# EAGLE design TSOC_GROVEY_I2CHUB_R2_1 (EAGLE 6.6.0)
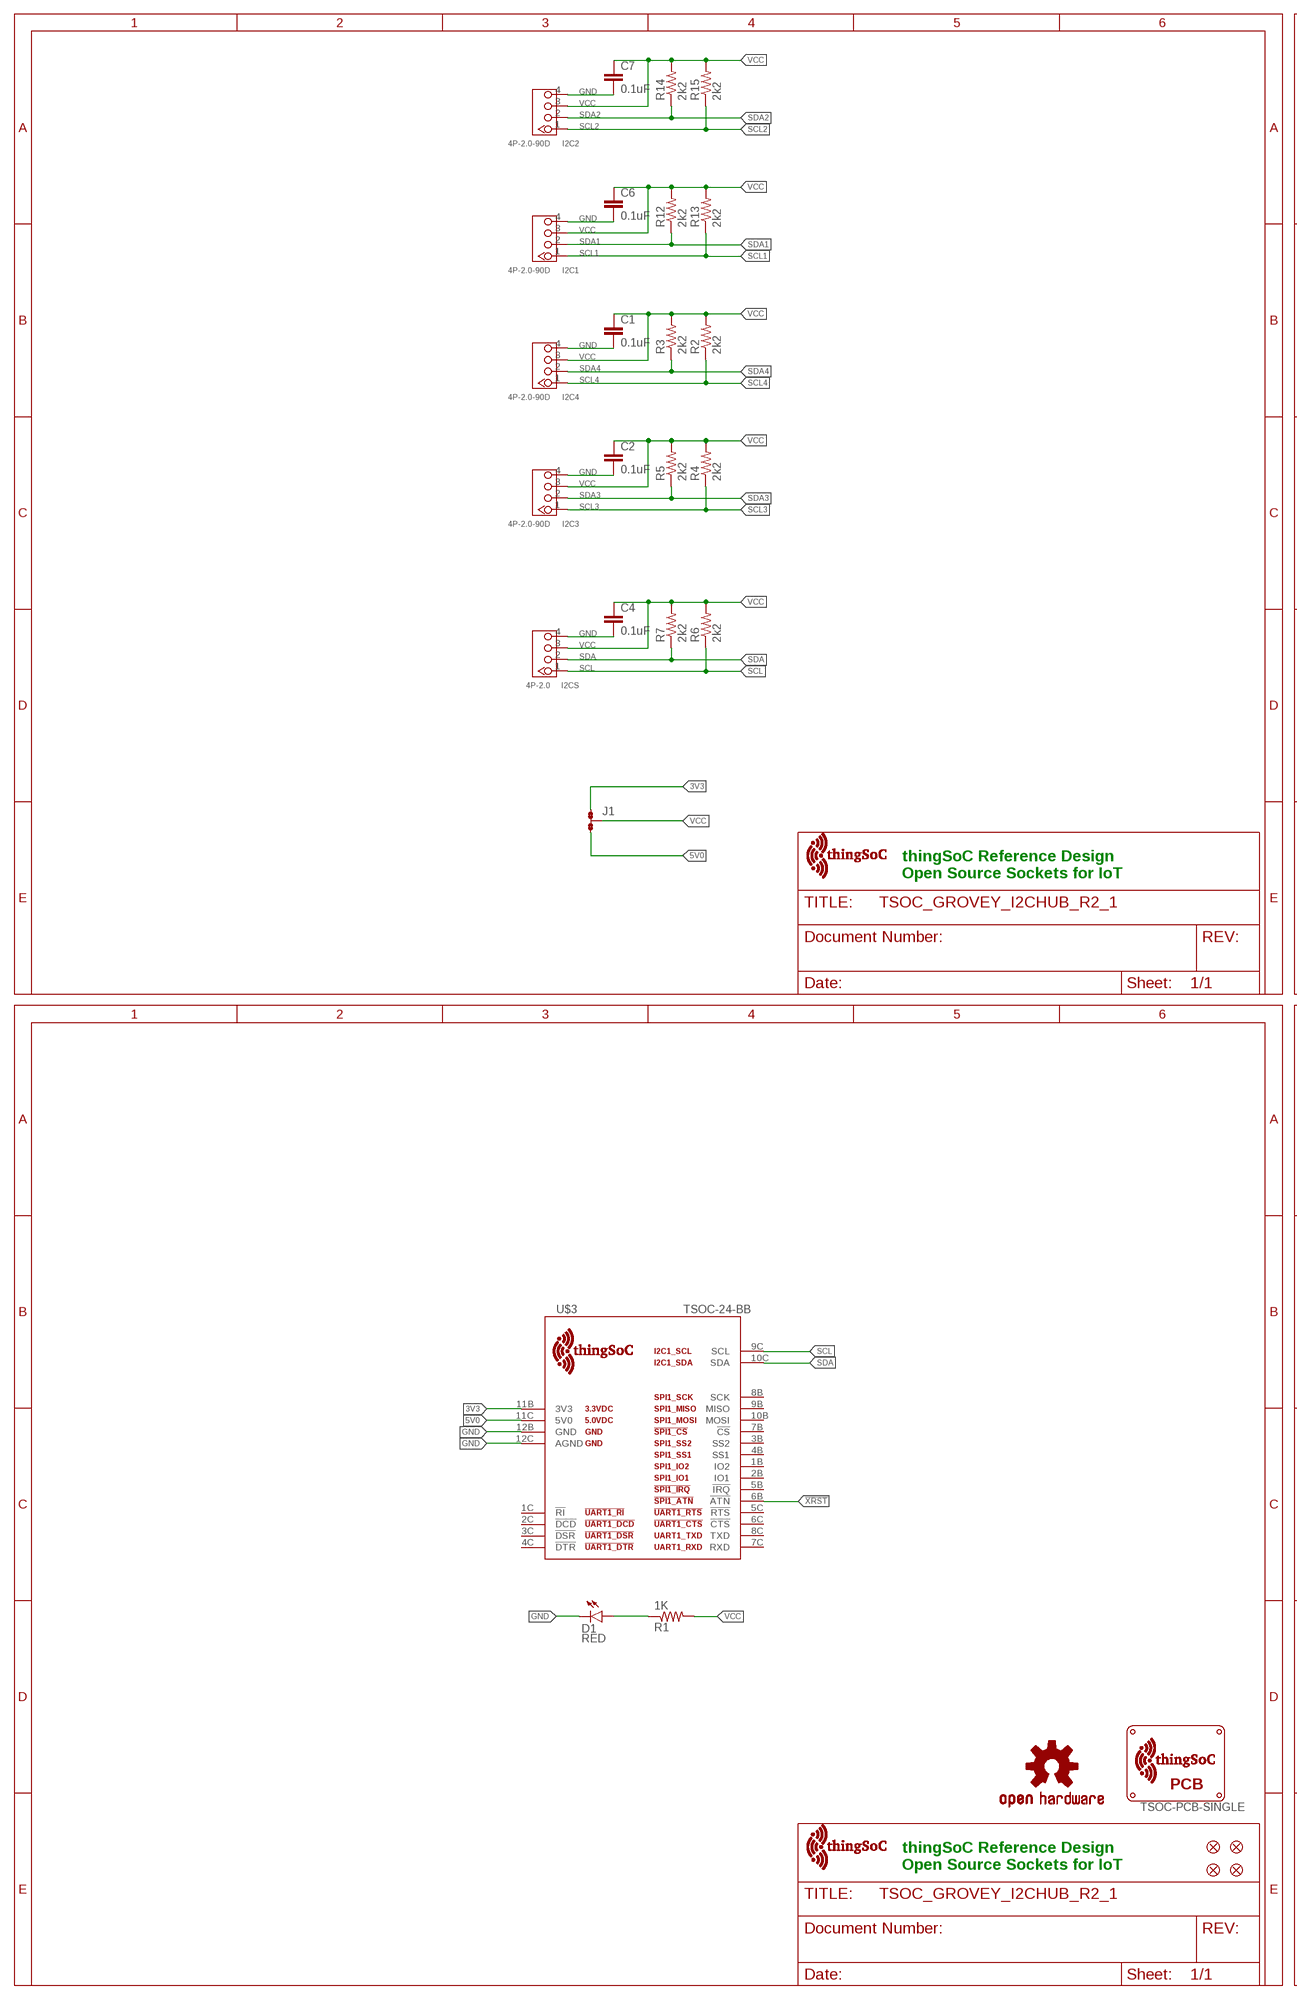
[diagram p0: schematic, sheet 1, part 1 of 2]
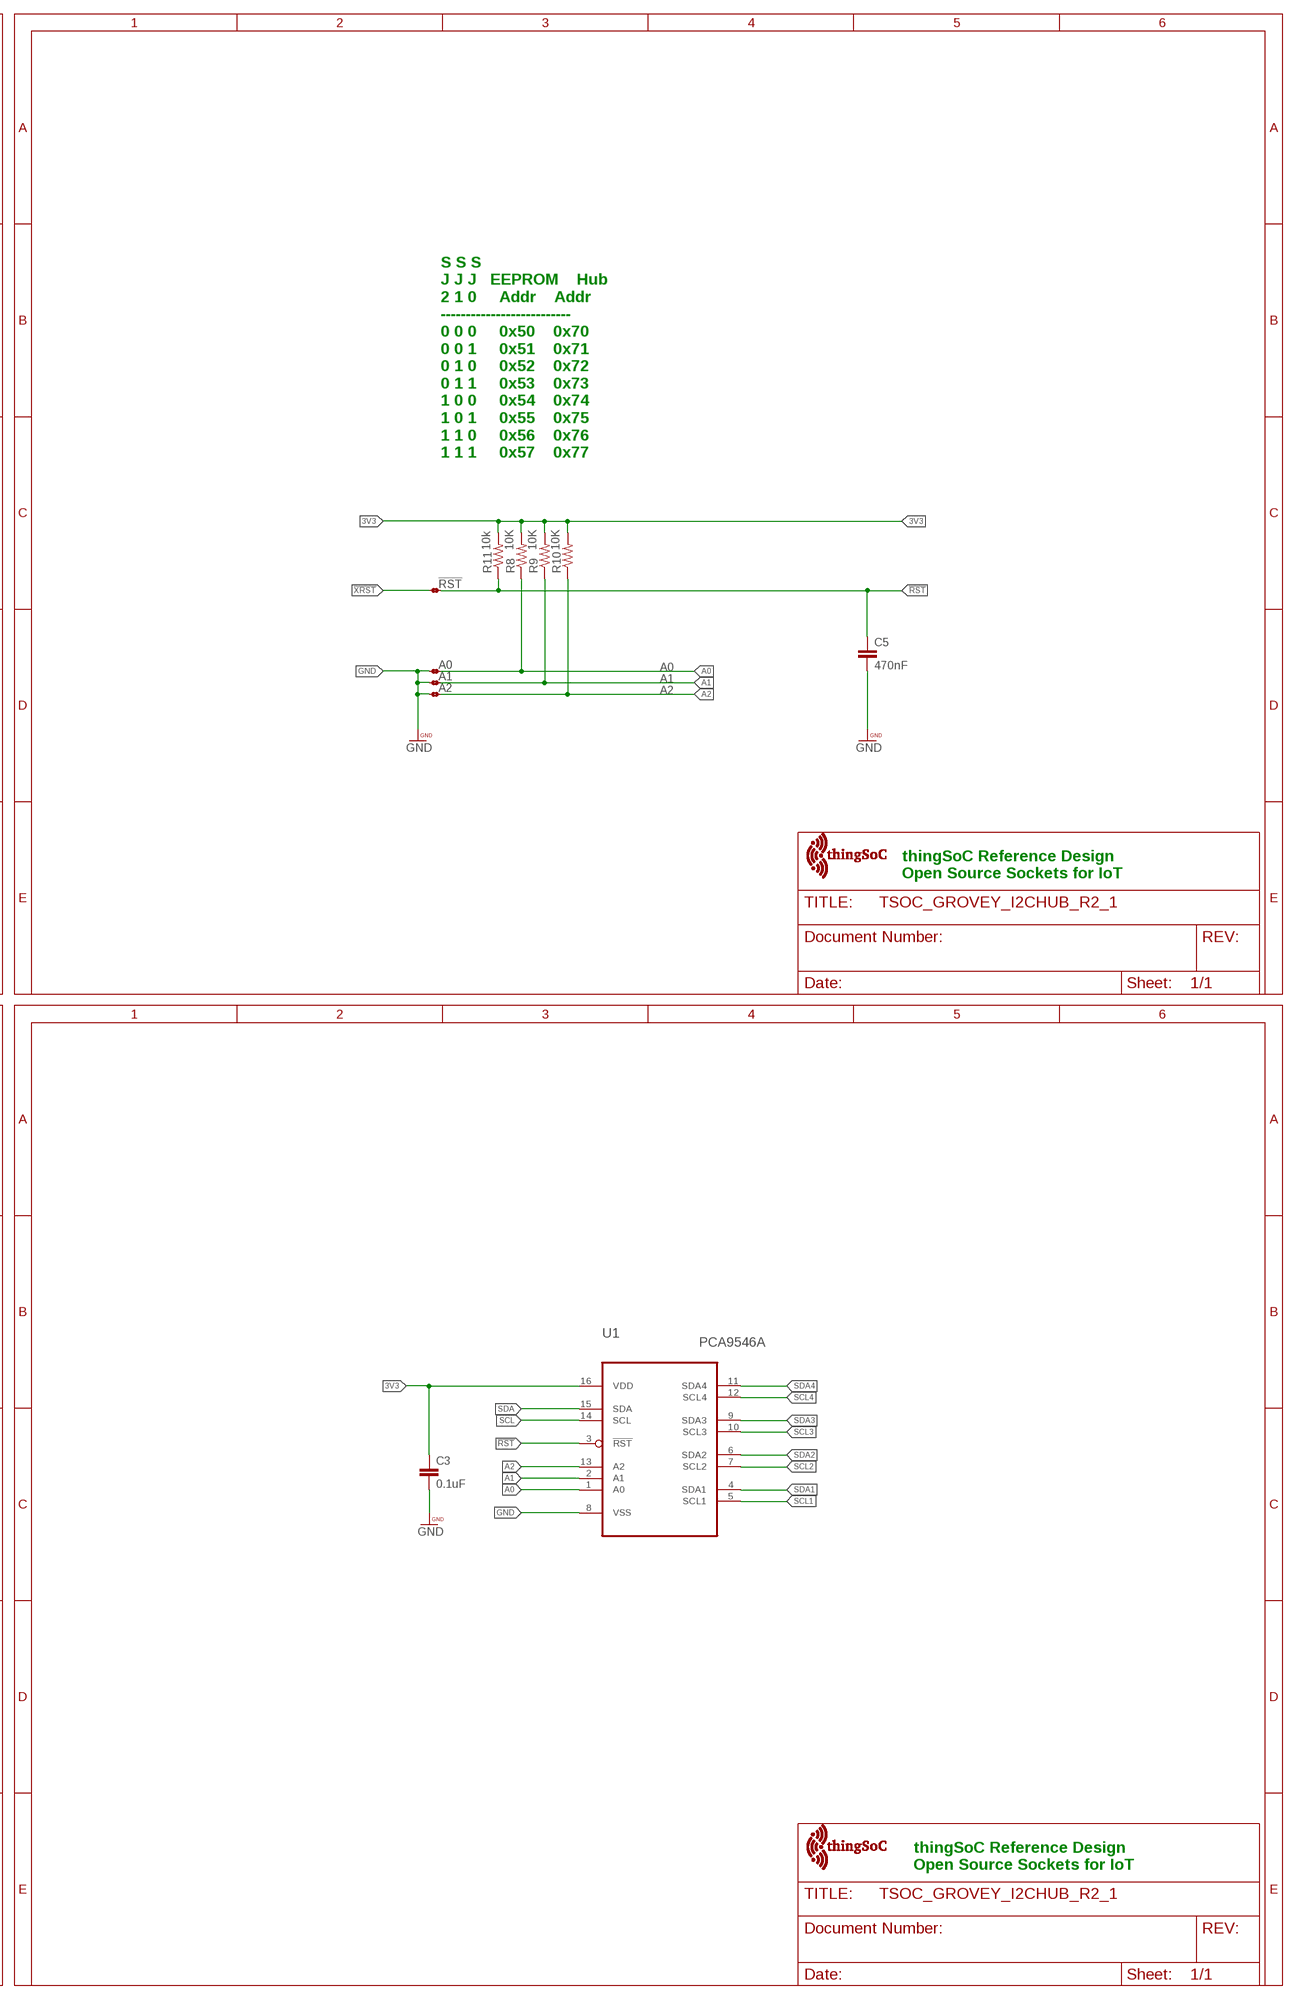
[diagram p1: schematic, sheet 1, part 2 of 2]

## Parts
!RST  NO  JMP-2-NO  [JMP-2-NO]
A0  NO  JMP-2-NO  [JMP-2-NO]
A1  NO  JMP-2-NO  [JMP-2-NO]
A2  NO  JMP-2-NO  [JMP-2-NO]
C1  0.1uF  CAP0603-CAP  [0603-CAP]
C2  0.1uF  CAP0603-CAP  [0603-CAP]
C3  0.1uF  CAP0603-CAP  [0603-CAP]
C4  0.1uF  CAP0603-CAP  [0603-CAP]
C5  470nF  CAP0603-CAP  [0603-CAP]
C6  0.1uF  CAP0603-CAP  [0603-CAP]
C7  0.1uF  CAP0603-CAP  [0603-CAP]
D1  RED  LED0603  [LED-0603]
FID1  FIDUCIALUFIDUCIAL  [MICRO-FIDUCIAL]
FID2  FIDUCIALUFIDUCIAL  [MICRO-FIDUCIAL]
FID3  FIDUCIALUFIDUCIAL  [MICRO-FIDUCIAL]
FID4  FIDUCIALUFIDUCIAL  [MICRO-FIDUCIAL]
I2C1  4P-2.0-90D  GROVE-CONNECTOR-DIP-90D(4P-2.0)  [HW4-2.0-90D]
I2C2  4P-2.0-90D  GROVE-CONNECTOR-DIP-90D(4P-2.0)  [HW4-2.0-90D]
I2C3  4P-2.0-90D  GROVE-CONNECTOR-DIP-90D(4P-2.0)  [HW4-2.0-90D]
I2C4  4P-2.0-90D  GROVE-CONNECTOR-DIP-90D(4P-2.0)  [HW4-2.0-90D]
I2CS  4P-2.0  GROVE-CONNECTOR-DIP(4P-2.0)  [HW4-2.0]
J1  NO  JMP-3-NO-PTH  [JMP-3-NO-PTH-2.54]
LOGO1  OSHW-LOGOL  [OSHW-LOGO-L]
R1  1K  RESISTOR_SFE0603-RES  [0603-RES]
R2  2k2  RESISTOR0603-RES  [0603-RES]
R3  2k2  RESISTOR0603-RES  [0603-RES]
R4  2k2  RESISTOR0603-RES  [0603-RES]
R5  2k2  RESISTOR0603-RES  [0603-RES]
R6  2k2  RESISTOR0603-RES  [0603-RES]
R7  2k2  RESISTOR0603-RES  [0603-RES]
R8  10K  RESISTOR0603-RES  [0603-RES]
R9  10K  RESISTOR0603-RES  [0603-RES]
R10  10K  RESISTOR0603-RES  [0603-RES]
R11  10k  RESISTOR0603-RES  [0603-RES]
R12  2k2  RESISTOR0603-RES  [0603-RES]
R13  2k2  RESISTOR0603-RES  [0603-RES]
R14  2k2  RESISTOR0603-RES  [0603-RES]
R15  2k2  RESISTOR0603-RES  [0603-RES]
U1  PCA9546A  [SOP65P640X110-16N]
U$1  TSOC-LOGO-SMALL  [TSOC-LOGO-SML]
U$2  TSOC-PCB-SINGLE  [TSOC-BB-BRD-DIM]
U$3  TSOC-24-BB  [TSOC-BB-S24]
U$101  TSOC-LOGO-LRG  [TSOC-LOGO-LRG]
U$102  TSOC-LOGO-SMALL  [TSOC-LOGO-SML]
U$103  TSOC-LOGO-SMALL  [TSOC-LOGO-SML]

## Nets
3V3: C3.1 J1.1 R8.2 R9.2 R10.2 R11.2 U1.16(VDD) U$3.11B(3V3)
5V0: J1.3 U$3.11C(5V0)
!RST: !RST.1 C5.1 R11.1 U1.3(!RST)
!XRST: !RST.2 U$3.6B(!ATN)
A0: A0.2 R8.1 U1.1(A0)
A1: A1.2 R9.1 U1.2(A1)
A2: A2.2 R10.1 U1.13(A2)
GND: A0.1 A1.1 A2.1 C1.2 C2.2 C3.2 C4.2 C5.2 C6.2 C7.2 D1.C I2C1.4 I2C2.4 I2C3.4 I2C4.4 I2CS.4 U1.8(VSS) U$3.12B(GND) U$3.12C(AGND)
N$17: D1.A R1.1
SCL: I2CS.1 R6.1 U1.14(SCL) U$3.9C(SCL)
SCL1: I2C1.1 R13.1 U1.5(SCL1)
SCL2: I2C2.1 R15.1 U1.7(SCL2)
SCL3: I2C3.1 R4.1 U1.10(SCL3)
SCL4: I2C4.1 R2.1 U1.12(SCL4)
SDA: I2CS.2 R7.1 U1.15(SDA) U$3.10C(SDA)
SDA1: I2C1.2 R12.1 U1.4(SDA1)
SDA2: I2C2.2 R14.1 U1.6(SDA2)
SDA3: I2C3.2 R5.1 U1.9(SDA3)
SDA4: I2C4.2 R3.1 U1.11(SDA4)
VCC: C1.1 C2.1 C4.1 C6.1 C7.1 I2C1.3 I2C2.3 I2C3.3 I2C4.3 I2CS.3 J1.2 R1.2 R2.2 R3.2 R4.2 R5.2 R6.2 R7.2 R12.2 R13.2 R14.2 R15.2
Unconnected: U$3.1B(IO2) U$3.1C(!RI) U$3.2B(IO1) U$3.2C(!DCD) U$3.3B(SS2) U$3.3C(!DSR) U$3.4B(SS1) U$3.4C(!DTR) U$3.5B(!IRQ) U$3.5C(!RTS) U$3.6C(!CTS) U$3.7B(!CS) U$3.7C(RXD) U$3.8B(SCK) U$3.8C(TXD) U$3.9B(MISO) U$3.10B(MOSI)

## Notes on the sheet
- S S S
  J J J   EEPROM    Hub
  2 1 0     Addr    Addr
  --------------------------
  0 0 0     0x50    0x70
  0 0 1     0x51    0x71
  0 1 0     0x52    0x72
  0 1 1     0x53    0x73
  1 0 0     0x54    0x74
  1 0 1     0x55    0x75
  1 1 0     0x56    0x76
  1 1 1     0x57    0x77
- thingSoC Reference Design
  Open Source Sockets for IoT
- thingSoC Reference Design
  Open Source Sockets for IoT
- thingSoC Reference Design
  Open Source Sockets for IoT
- thingSoC Reference Design
  Open Source Sockets for IoT

## Library data of the parts
!RST A0 A1 A2 = scratch-ProtoPads:JMP-2-NO: Basic Jumper - Normally Open Positions 1 and 2 are normally NOT connected. PatternAgents ProtoPads Library Schematic and PCB layout libraries for design patterns by PatternAgents. For the CADSoft Eagle CAD program : http://www.cadsoftusa.com/download-eagle/ Source LBR : http://www.patternagents.com Github : https://github.com/PatternAgents License : http://creativecommons.org/licenses/by-sa/4.0/ (Creative Commons 4.0) THIS SOFTWARE IS PROVIDED BY THE CONTRIBUTORS "AS IS" AND WITHOUT ANY EXPRESS OR IMPLIED WARRANTIES, INCLUDING, BUT NOT LIMITED TO, THE IMPLIED WARRANTIES OF MERCHANTABILITY AND FITNESS FOR A PARTICULAR PURPOSE ARE DISCLAIMED. IN NO EVENT SHALL THE COPYRIGHT OWNER OR CONTRIBUTORS BE LIABLE FOR ANY DIRECT, INDIRECT, INCIDENTAL, SPECIAL, EXEMPLARY, OR CONSEQUENTIAL DAMAGES (INCLUDING, BUT NOT LIMITED TO, PROCUREMENT OF SUBSTITUTE GOODS OR SERVICES; LOSS OF USE, DATA, OR PROFITS; OR BUSINESS INTERRUPTION) HOWEVER CAUSED AND ON ANY THEORY OF LIABILITY, WHETHER IN CONTRACT, STRICT LIABILITY, OR TORT (INCLUDING NEGLIGENCE OR OTHERWISE) ARISING IN ANY WAY OUT OF THE USE OF THIS SOFTWARE, EVEN IF ADVISED OF THE POSSIBILITY OF SUCH DAMAGE.; BOM: EXCLUDE
C1-C7 = SparkFun-Passives:CAP: Capacitor Standard 0603 ceramic capacitor, and 0.1" leaded capacitor.
D1 = TSOC-ESP8266-BASE:LED: LEDs Standard schematic elements and footprints for 5mm, 3mm, 1206, and 0603 sized LEDs. 5mm - Spark Fun Electronics SKU : COM-00529 (and others)
FID1-FID4 = TSOC-ESP8266-BASE:FIDUCIAL: Fiducial Alignment Points Various fiducial points for machine vision alignment.
I2C1-I2C4 = Seeed-Connector -2016:GROVE-CONNECTOR-DIP-90D(4P-2.0): 320110034
I2CS = Seeed-Connector -2016:GROVE-CONNECTOR-DIP(4P-2.0): 320110033
J1 = PatternAgents-ProtoPads:JMP-3-NO: Three Terminal Jumper - Normally Open All Pads Open (unconnected) PatternAgents ProtoPads Library Schematic and PCB layout libraries for design patterns by PatternAgents. For the CADSoft Eagle CAD program : http://www.cadsoftusa.com/download-eagle/ Source LBR : http://www.patternagents.com Github : https://github.com/PatternAgents License : http://creativecommons.org/licenses/by-sa/4.0/ (Creative Commons 4.0) THIS SOFTWARE IS PROVIDED BY THE CONTRIBUTORS "AS IS" AND WITHOUT ANY EXPRESS OR IMPLIED WARRANTIES, INCLUDING, BUT NOT LIMITED TO, THE IMPLIED WARRANTIES OF MERCHANTABILITY AND FITNESS FOR A PARTICULAR PURPOSE ARE DISCLAIMED. IN NO EVENT SHALL THE COPYRIGHT OWNER OR CONTRIBUTORS BE LIABLE FOR ANY DIRECT, INDIRECT, INCIDENTAL, SPECIAL, EXEMPLARY, OR CONSEQUENTIAL DAMAGES (INCLUDING, BUT NOT LIMITED TO, PROCUREMENT OF SUBSTITUTE GOODS OR SERVICES; LOSS OF USE, DATA, OR PROFITS; OR BUSINESS INTERRUPTION) HOWEVER CAUSED AND ON ANY THEORY OF LIABILITY, WHETHER IN CONTRACT, STRICT LIABILITY, OR TORT (INCLUDING NEGLIGENCE OR OTHERWISE) ARISING IN ANY WAY OUT OF THE USE OF THIS SOFTWARE, EVEN IF ADVISED OF THE POSSIBILITY OF SUCH DAMAGE.
LOGO1 = SparkFun-Aesthetics:OSHW-LOGO: Open Source Hardware Logo This logo indicates the piece of hardware it is found on incorporates a OSHW license and/or adheres to the definition of open source hardware found here: http://freedomdefined.org/OSHW
R1 = PatternAgents-Misc:RESISTOR_SFE: Resistor Basic schematic elements and footprints for 0603, 1206, and PTH resistors.
R2-R15 = SparkFun-Passives:RESISTOR: Resistor Basic schematic elements and footprints for 0603, 1206, and PTH resistors.
U1 = PatternAgents-NXP:PCA9546A: 4-channel I2C-bus switch with reset; MPN: PCA9546APW,112; OC_FARNELL: 1831208; OC_NEWARK: 70R6610; PACKAGE: TSSOP-16; SUPPLIER: NXP
U$1 U$101-U$103 = thingSoC:TSOC-LOGO: thingSoC Logo Source LBR : http://www.thingsoc.com Github : https://github.com/thingsoc License : http://creativecommons.org/licenses/by-sa/4.0/ (Creative Commons 4.0) THIS SOFTWARE IS PROVIDED BY THE CONTRIBUTORS "AS IS" AND WITHOUT ANY EXPRESS OR IMPLIED WARRANTIES, INCLUDING, BUT NOT LIMITED TO, THE IMPLIED WARRANTIES OF MERCHANTABILITY AND FITNESS FOR A PARTICULAR PURPOSE ARE DISCLAIMED. IN NO EVENT SHALL THE COPYRIGHT OWNER OR CONTRIBUTORS BE LIABLE FOR ANY DIRECT, INDIRECT, INCIDENTAL, SPECIAL, EXEMPLARY, OR CONSEQUENTIAL DAMAGES (INCLUDING, BUT NOT LIMITED TO, PROCUREMENT OF SUBSTITUTE GOODS OR SERVICES; LOSS OF USE, DATA, OR PROFITS; OR BUSINESS INTERRUPTION) HOWEVER CAUSED AND ON ANY THEORY OF LIABILITY, WHETHER IN CONTRACT, STRICT LIABILITY, OR TORT (INCLUDING NEGLIGENCE OR OTHERWISE) ARISING IN ANY WAY OUT OF THE USE OF THIS SOFTWARE, EVEN IF ADVISED OF THE POSSIBILITY OF SUCH DAMAGE.
U$2 = thingSoC:TSOC-PCB: thingSoC PCB Outlines Boards Outlines for Standard Sizes (in the DImension Layer) (Registration marks in the tDocu layer - make sure to turn on tDocu/bDocu) Source LBR : http://www.thingsoc.com Github : https://github.com/thingsoc License : http://creativecommons.org/licenses/by-sa/4.0/ (Creative Commons 4.0) THIS SOFTWARE IS PROVIDED BY THE CONTRIBUTORS "AS IS" AND WITHOUT ANY EXPRESS OR IMPLIED WARRANTIES, INCLUDING, BUT NOT LIMITED TO, THE IMPLIED WARRANTIES OF MERCHANTABILITY AND FITNESS FOR A PARTICULAR PURPOSE ARE DISCLAIMED. IN NO EVENT SHALL THE COPYRIGHT OWNER OR CONTRIBUTORS BE LIABLE FOR ANY DIRECT, INDIRECT, INCIDENTAL, SPECIAL, EXEMPLARY, OR CONSEQUENTIAL DAMAGES (INCLUDING, BUT NOT LIMITED TO, PROCUREMENT OF SUBSTITUTE GOODS OR SERVICES; LOSS OF USE, DATA, OR PROFITS; OR BUSINESS INTERRUPTION) HOWEVER CAUSED AND ON ANY THEORY OF LIABILITY, WHETHER IN CONTRACT, STRICT LIABILITY, OR TORT (INCLUDING NEGLIGENCE OR OTHERWISE) ARISING IN ANY WAY OUT OF THE USE OF THIS SOFTWARE, EVEN IF ADVISED OF THE POSSIBILITY OF SUCH DAMAGE.
U$3 = thingSoC:TSOC-24: thingSoC Twenty-Four(24) Pin Socket Source LBR : http://www.thingsoc.com Github : https://github.com/thingsoc License : http://creativecommons.org/licenses/by-sa/4.0/ (Creative Commons 4.0) THIS SOFTWARE IS PROVIDED BY THE CONTRIBUTORS "AS IS" AND WITHOUT ANY EXPRESS OR IMPLIED WARRANTIES, INCLUDING, BUT NOT LIMITED TO, THE IMPLIED WARRANTIES OF MERCHANTABILITY AND FITNESS FOR A PARTICULAR PURPOSE ARE DISCLAIMED. IN NO EVENT SHALL THE COPYRIGHT OWNER OR CONTRIBUTORS BE LIABLE FOR ANY DIRECT, INDIRECT, INCIDENTAL, SPECIAL, EXEMPLARY, OR CONSEQUENTIAL DAMAGES (INCLUDING, BUT NOT LIMITED TO, PROCUREMENT OF SUBSTITUTE GOODS OR SERVICES; LOSS OF USE, DATA, OR PROFITS; OR BUSINESS INTERRUPTION) HOWEVER CAUSED AND ON ANY THEORY OF LIABILITY, WHETHER IN CONTRACT, STRICT LIABILITY, OR TORT (INCLUDING NEGLIGENCE OR OTHERWISE) ARISING IN ANY WAY OUT OF THE USE OF THIS SOFTWARE, EVEN IF ADVISED OF THE POSSIBILITY OF SUCH DAMAGE.

## Board
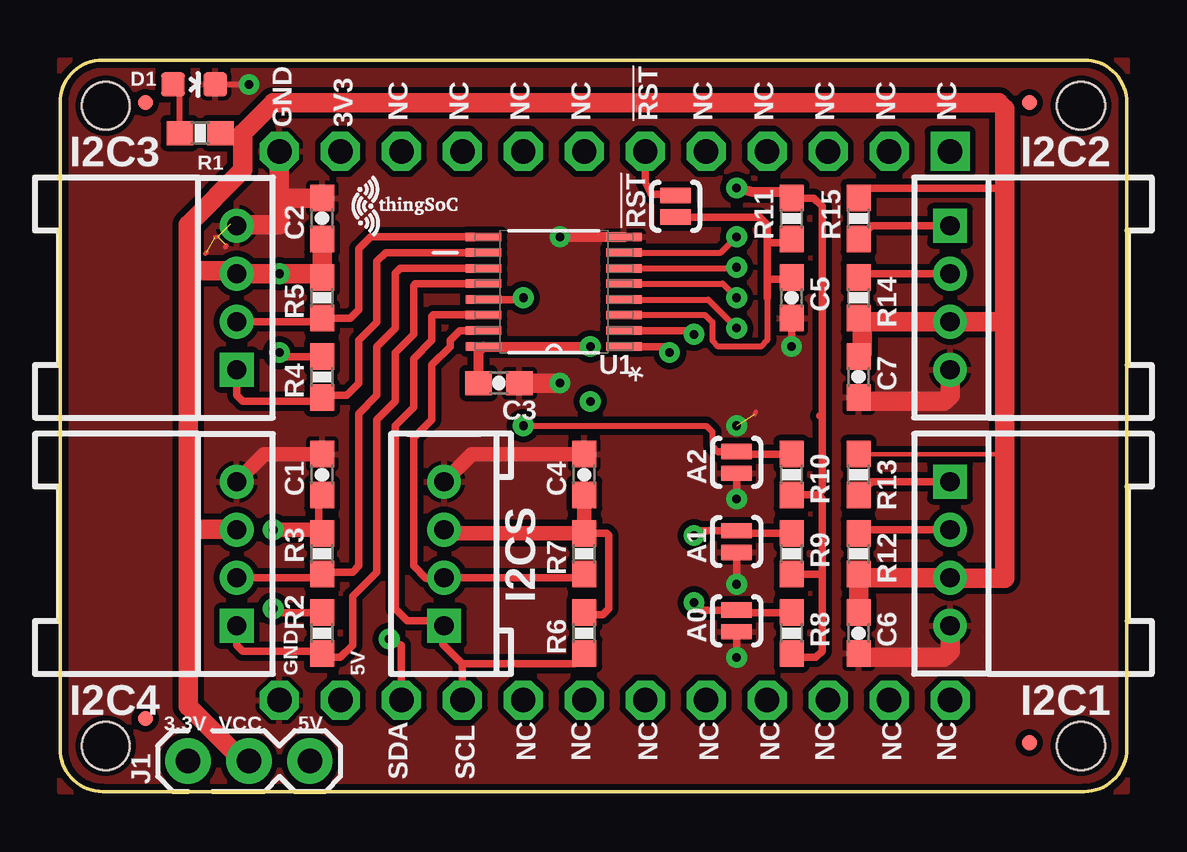
[diagram p2: board, top side]
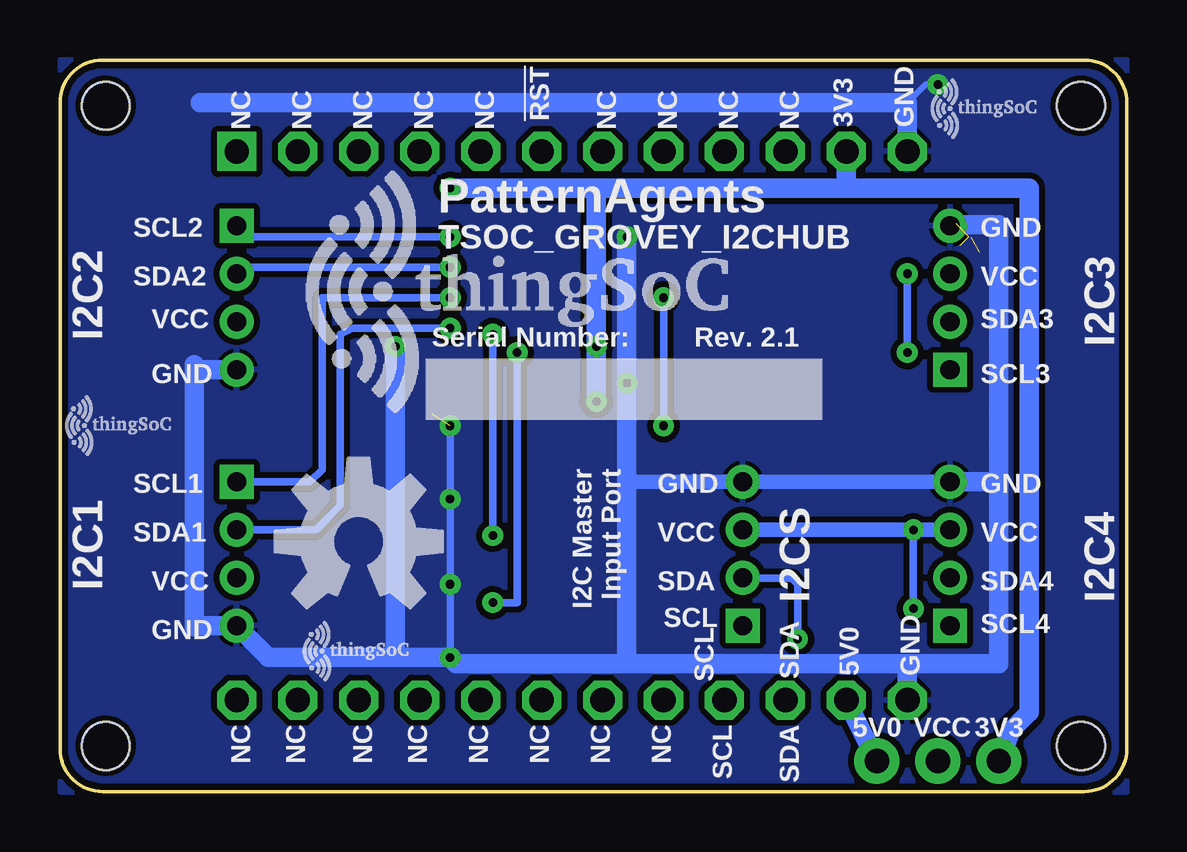
[diagram p3: board, bottom side, seen from below]

Size 44.45 x 30.48 mm. Coordinates in mm from the lower left corner, seen from the top.
Copper layers (1*16): Top 0.035mm / dielectric 1.5mm / Bottom 0.035mm
Design rules "PatternAgents_7mil": minimum track width 7mil, minimum drill 14mil, track to track 7mil, track to pad 7mil, pad to pad 7mil, via to via 7mil, smd to smd 7mil, copper to edge 7mil, drill to drill 7mil, minimum pad ring 12mil, minimum via ring 10mil, stop-mask expansion 4mil, vias tented up to drill 25mil, thermal gap 7mil

### Footprints (pad centres in the part's own frame; a part is rotated, then mirrored left to right if it is on the bottom)
JMP-2-NO = smd 0.635 x 1.27: 1 -0.45,0; 2 0.45,0
0603-CAP = smd 1.1 x 1: 1 -0.85,0; 2 0.85,0
LED-0603 = smd 1 x 1: A 0,-0.877; C 0,0.877
MICRO-FIDUCIAL = smd 0.635 x 0.635: 1 0,0
HW4-2.0-90D = drill 0.8 pad 1.27 square: 1 -3,0 | drill 0.8 pad 1.27: 2 -1,0; 3 1,0; 4 3,0
HW4-2.0 = drill 0.8 pad 1.27 square: 1 -3,0 | drill 0.8 pad 1.27: 2 -1,0; 3 1,0; 4 3,0
JMP-3-NO-PTH-2.54 = drill 1.016 pad 1.88: 1 0,0; 2 2.54,0; 3 5.08,0
0603-RES = smd 1.1 x 1: 1 -0.85,0; 2 0.85,0
SOP65P640X110-16N = smd 1.473 x 0.356: 1 -2.921,2.286; 2 -2.921,1.626; 3 -2.921,0.965; 4 -2.921,0.33; 5 -2.921,-0.33; 6 -2.921,-0.965; 7 -2.921,-1.626; 8 -2.921,-2.286; 9 2.921,-2.286; 10 2.921,-1.626; 11 2.921,-0.965; 12 2.921,-0.33; 13 2.921,0.33; 14 2.921,0.965; 15 2.921,1.626; 16 2.921,2.286
TSOC-BB-BRD-DIM = hole 2: 13.335,16.891; -13.335,16.891; 13.335,-23.749; -13.335,-23.749
TSOC-BB-S24 = drill 1.016 square: 1B -11.43,11.43 | drill 1.016 octagon: 1C 11.43,11.43; 2B -11.43,8.89; 2C 11.43,8.89; 3B -11.43,6.35; 3C 11.43,6.35; 4B -11.43,3.81; 4C 11.43,3.81; 5B -11.43,1.27; 5C 11.43,1.27; 6B -11.43,-1.27; 6C 11.43,-1.27; 7B -11.43,-3.81; 7C 11.43,-3.81; 8B -11.43,-6.35; 8C 11.43,-6.35; 9B -11.43,-8.89; 9C 11.43,-8.89; 10B -11.43,-11.43; 10C 11.43,-11.43; 11B -11.43,-13.97; 11C 11.43,-13.97; 12B -11.43,-16.51; 12C 11.43,-16.51

### Placement (x,y rotation side)
!RST  25.65,24.38 90 top
A0  28.19,7.11 90 top
A1  28.19,10.41 90 top
A2  28.19,13.72 90 top
C1  10.92,13.21 90 top
C2  10.92,23.88 90 top
C3  18.29,17.02 0 top
C4  21.84,13.21 90 top
C5  30.48,20.57 270 top
C6  33.27,6.6 270 top
C7  33.27,17.27 270 top
D1  5.59,29.46 270 top
FID1  3.56,3.05 0 top
FID2  3.56,28.7 0 top
FID3  40.39,2.03 0 top
FID4  40.39,28.7 0 top
I2C1  37.08,9.91 270 top
I2C2  37.08,20.57 270 top
I2C3  7.37,20.57 90 top
I2C4  7.37,9.91 90 top
I2CS  16,9.91 90 top
J1  5.33,1.27 0 top
LOGO1  32,10.41 0 bottom
R1  5.84,27.43 0 top
R2  10.92,6.6 90 top
R3  10.92,9.91 90 top
R4  10.92,17.27 90 top
R5  10.92,20.57 90 top
R6  21.84,6.6 90 top
R7  21.84,9.91 90 top
R8  30.48,6.6 270 top
R9  30.48,9.91 270 top
R10  30.48,13.21 270 top
R11  30.48,23.88 90 top
R12  33.27,9.91 270 top
R13  33.27,13.21 90 top
R14  33.27,20.57 270 top
R15  33.27,23.88 90 top
U1  20.57,20.83 180 top
U$1  12.95,24.38 0 top
U$2  25.65,15.24 270 top
U$3  25.65,15.24 270 top
U$100  TSOC-LOGO-SMALL  [TSOC-LOGO-SML]  7.37,28.45 0 bottom
U$101  30.99,20.83 0 bottom
U$102  33.53,5.84 0 bottom
U$103  43.43,15.24 0 bottom

### Tracks (layer width: path | path; a pad name or v marks a point on that pad's centre or on a via)
3V3  (via drill 0.36)
  Top 0.305: R10.2 31.58,12.36 | 31.58,12.36 31.75,12.19 31.75,9.14 | 31.75,9.14 31.75,5.84 31.5,5.59 30.65,5.59 R8.2 | R9.2 31.66,9.06 31.75,9.14 | 31.75,15.75 31.75,24.38 31.41,24.73 R11.2 30.73,24.98 | 31.75,15.75 31.75,12.52 31.58,12.36 | 31.66,15.66 31.75,15.75
  Top 0.406: 30.73,24.98 28.87,24.98 v28.19,25.15 | v22.1,18.54 U1.16 17.44,18.33 C3.1
  Bottom 0.813: U$3.11B 11.68,25.15 | 22.1,25.15 11.68,25.15 | J1.1 4.83,2.54 4.06,3.3 4.06,25.15 11.68,25.15 | v22.1,16.26 v22.1,18.54 22.1,25.15 | v28.19,25.15 22.1,25.15
5V0
  Bottom 0.813: J1.3 U$3.11C
!RST
  Top 0.254: 29.46,20.57 29.46,18.8 29.21,18.54 27.43,18.54 27.18,18.8 27.18,19.56 26.87,19.86 U1.3
  Top 0.305: R11.1 30.31,22.86 29.46,22.86 | 30.31,21.59 C5.1 30.39,21.34 29.46,21.34 | !RST.1 29.15,23.93 29.46,23.62 29.46,22.86 | 29.46,20.57 29.46,21.34 | 29.46,21.34 29.46,22.86
!XRST
  Top 0.305: U$3.6B 24.38,25.4 24.64,24.89 25.6,24.89 !RST.2
A0  (via drill 0.36)
  Top 0.305: R8.1 28.3,7.45 A0.2 26.73,7.56 v26.42,7.87 | U1.1 25.15,18.54 v25.4,18.29
  Bottom 0.305: v25.4,18.29 25.4,7.87 v26.42,7.87
A1  (via drill 0.36)
  Top 0.305: R9.1 28.3,10.76 A1.2 26.61,10.86 v26.42,10.67 26.29,10.54 | U1.2 26.26,19.2 v26.42,19.05
  Bottom 0.305: v26.42,10.67 v26.42,19.05
A2  (via drill 0.36)
  Top 0.254: v19.3,15.24 26.92,15.24 27.18,14.99 27.18,14.42 27.43,14.17
  Top 0.305: R10.1 28.3,14.06 A2.2 27.43,14.17 | U1.13 19.23,20.5 v19.3,20.57
  Bottom 0.305: v19.3,15.24 v19.3,20.57
GND  (via drill 0.36)  (4 unrouted)
  Top 0.178: 28.98,15.82 28.95,15.71 | 6.04,22.4 6.12,22.48 | 7.11,23.65 I2C3.4 | 7.11,23.65 | I2C3.4 7.29,23.47 7.29,23.5 | 6.58,23.11 6.47,23.1 | 6.93,22.76 6.88,22.68 | I2C3.4 7.29,23.65
  Top 0.254: D1.C v7.87,29.46
  Top 0.305: A2.1 v28.19,12.19 | v28.19,8.64 A1.1 | A0.1 v28.19,5.59 | C5.2 v30.48,18.54
  Top 0.406: v20.83,23.11 U1.8
  Top 0.61: C1.2 8.52,14.06 I2C4.4 | C4.2 17.15,14.06 I2CS.4
  Top 0.813: C6.2 33.44,5.59 36.83,5.59 37.08,5.84 I2C1.4 | C7.2 33.44,16.26 36.83,16.26 37.08,16.51 I2C2.4 | C3.2 v20.83,17.02 | U$3.12B 9.14,24.64 | 9.14,24.64 9.14,23.62 7.41,23.62 I2C3.4 | C2.2 9.23,24.73 9.14,24.64
  Bottom 0.178: I2C3.4 7.39,23.65 7.39,23.62
  Bottom 0.254: v7.87,29.46 8.38,29.46 9.14,28.7
  Bottom 0.305: v28.19,5.59 v28.19,8.64 v28.19,12.19 v28.19,15.24 | 23.11,28.45 22.61,28.7
  Bottom 0.61: I2CS.4 20.78,12.91 20.83,12.95 | I2C4.4 15.95,12.91 16,12.95
  Bottom 0.813: 38.61,28.7 22.61,28.7 9.14,28.7 U$3.12B | I2C2.4 38.66,17.57 38.86,17.78 38.86,6.86 38.81,6.91 I2C1.4 35.77,5.59 30.48,5.59 | 5.33,12.95 5.33,5.33 9.14,5.33 | 5.33,12.95 5.33,23.37 | 5.33,23.37 5.33,23.62 | I2C4.4 5.64,12.91 5.33,12.95 | 7.41,23.62 7.39,23.62 5.59,23.62 5.33,23.37 | v20.83,23.11 v20.83,17.02 20.83,12.95 20.83,5.33 | 9.14,5.33 12.95,5.33 20.83,5.33 | 20.83,5.33 27.94,5.33 v28.19,5.59 30.48,5.59 | U$3.12C 9.14,5.33 | v30.48,18.54 30.48,5.59
  pour Top (isolate 0.254, rank 2, hatched): 0,0 0,30.48 44.45,30.48 44.45,0
  pour Bottom (isolate 0.254, rank 2, hatched): 0,0 0,30.48 44.45,30.48 44.45,0
N$17
  Top 0.254: R1.1 4.99,29.18 D1.A
SCL
  Top 0.178: I2CS.1 16,6.93 15.95,6.93
  Top 0.305: U1.14 15.54,19.86 15.49,19.81 15.49,18.8 14.73,18.03 14.73,16 13.97,15.24 13.97,7.62 14.48,7.11 15.95,7.11 15.95,6.93 15.95,6.14 16.76,5.33 | 16.76,5.33 21.42,5.33 R6.1 | 16.76,5.33 U$3.9C
SCL1  (via drill 0.36)
  Top 0.254: U1.5 27.61,21.16 v28.19,20.57
  Top 0.305: I2C1.1 33.82,12.91 R13.1
  Bottom 0.305: v28.19,20.57 33.53,20.57 33.53,13.41 34.04,12.91 I2C1.1
SCL2  (via drill 0.36)
  Top 0.254: U1.7 27.53,22.45 v28.19,23.11
  Top 0.305: I2C2.1 33.82,23.57 R15.1
  Bottom 0.305: v28.19,23.11 36.37,23.11 I2C2.1
SCL3
  Top 0.305: I2C3.1 7.37,16.51 7.62,16.26 10.76,16.26 R4.1 11.01,16.51 11.94,16.51 12.45,17.02 12.45,18.8 13.21,19.56 13.21,22.1 13.56,22.45 U1.10
SCL4
  Top 0.305: I2C4.1 7.37,6.1 7.62,5.84 10.83,5.84 R2.1 11.09,5.59 11.68,5.59 12.19,6.1 12.19,8.13 13.21,9.14 13.21,15.49 13.97,16.26 13.97,18.29 14.73,19.05 14.73,21.08 14.81,21.16 U1.12
SDA  (via drill 0.36)
  Top 0.305: U1.15 16.66,19.2 16.26,18.8 16.26,18.54 15.49,17.78 15.49,15.49 14.73,14.73 14.73,9.4 15.24,8.89 15.99,8.89 I2CS.2 21.69,8.91 R7.1 21.74,9.16 | U$3.10C 14.22,6.1 v13.72,6.35
  Bottom 0.305: v13.72,6.35 13.72,8.64 13.97,8.89 15.99,8.89 I2CS.2
SDA1  (via drill 0.36)
  Top 0.254: U1.4 27,20.5 v28.19,19.3
  Top 0.305: I2C1.2 33.42,10.91 R12.1
  Bottom 0.305: v28.19,19.3 32.26,19.3 32.77,19.05 32.77,11.92 33.78,10.91 I2C1.2
SDA2  (via drill 0.36)
  Top 0.254: U1.6 28.14,21.79 v28.19,21.84
  Top 0.305: I2C2.2 33.42,21.57 R14.1
  Bottom 0.305: v28.19,21.84 36.81,21.84 I2C2.2
SDA3
  Top 0.305: I2C3.2 10.77,19.57 R5.1 12.1,19.72 12.45,20.07 12.45,22.61 12.95,23.11 U1.9
SDA4
  Top 0.305: I2C4.2 10.77,8.91 R3.1 11.01,9.14 12.19,9.14 12.45,9.4 12.45,15.75 13.21,16.51 13.21,18.54 13.97,19.3 13.97,21.59 14.17,21.79 U1.11
VCC  (via drill 0.36)
  Top 0.178: 39.37,14.05 33.35,14.05 R13.2 | 33.35,25.15 33.35,24.89 R15.2 | 7.04,21.69 I2C3.3
  Top 0.254: R1.2 7.62,27.43
  Top 0.305: 33.27,25.15 33.35,25.15 39.37,25.15 | R4.2 9.31,18.12 v9.14,18.29 | 11.01,12.45 C1.1 10.77,12.21 10.77,10.91 R3.2 | R2.2 9.06,7.45 v8.89,7.62 | R7.2 22.77,10.76 22.86,10.67 22.86,7.62 22.61,7.37 21.93,7.37 R6.2
  Top 0.61: I2CS.3 16.15,10.76 R7.2 C4.1 | 10.77,10.91 v8.89,10.91
  Top 0.813: 33.42,19.57 33.42,18.27 C7.1 | C6.1 R12.2 33.42,8.91 I2C1.3 37.1,8.89 39.37,8.89 39.37,14.05 39.37,19.56 | C2.1 R5.2 10.77,21.57 v9.14,21.57 I2C3.3 | 39.37,19.56 39.37,25.15 39.37,28.45 39.12,28.7 8.89,28.7 7.62,27.43 7.62,25.91 5.33,23.62 5.33,21.69 | 39.37,19.56 39.35,19.57 I2C2.3 33.42,19.57 | 33.42,19.57 R14.2 | 5.33,21.69 5.33,10.92 | 5.33,10.92 7.35,10.92 I2C4.3 | J1.2 7.37,1.52 5.33,3.56 5.33,10.92 | 5.33,21.69 7.04,21.69
  Bottom 0.305: v9.14,18.29 v9.14,21.57 | v8.89,7.62 v8.89,10.91
  Bottom 0.61: I2CS.3 v8.89,10.91 I2C4.3

### Text on the board
tPlace: GND | 3V3 | NC | NC | NC | NC | !RST | NC | NC | NC | NC | NC | GND | 5V | 3.3V | VCC | 5V | SDA | SCL | NC | NC | NC | NC | NC | NC | NC | NC
bPlace: !RST | NC | NC | NC | NC | NC | NC | NC | NC | NC | GND | 3V3 | PatternAgents | GND | TSOC_GROVEY_I2CHUB | SCL2 | VCC | SDA2 | I2C3 | SDA3 | Rev. 2.1 | Serial Number: | VCC | I2C2 | SCL3 | GND | I2C Master / Input Port | GND | GND | SCL1 | VCC | VCC | SDA1 | I2C4 | SDA4 | I2CS | SDA | VCC | I2C1 | SCL4 | SDA | SCL | SCL | GND | GND | 5V0 | SDA | SCL | NC | NC | NC | NC | NC | NC | NC | NC | 3V3 | VCC | 5V0